# Altium project 2015PCB1.PrjPCB
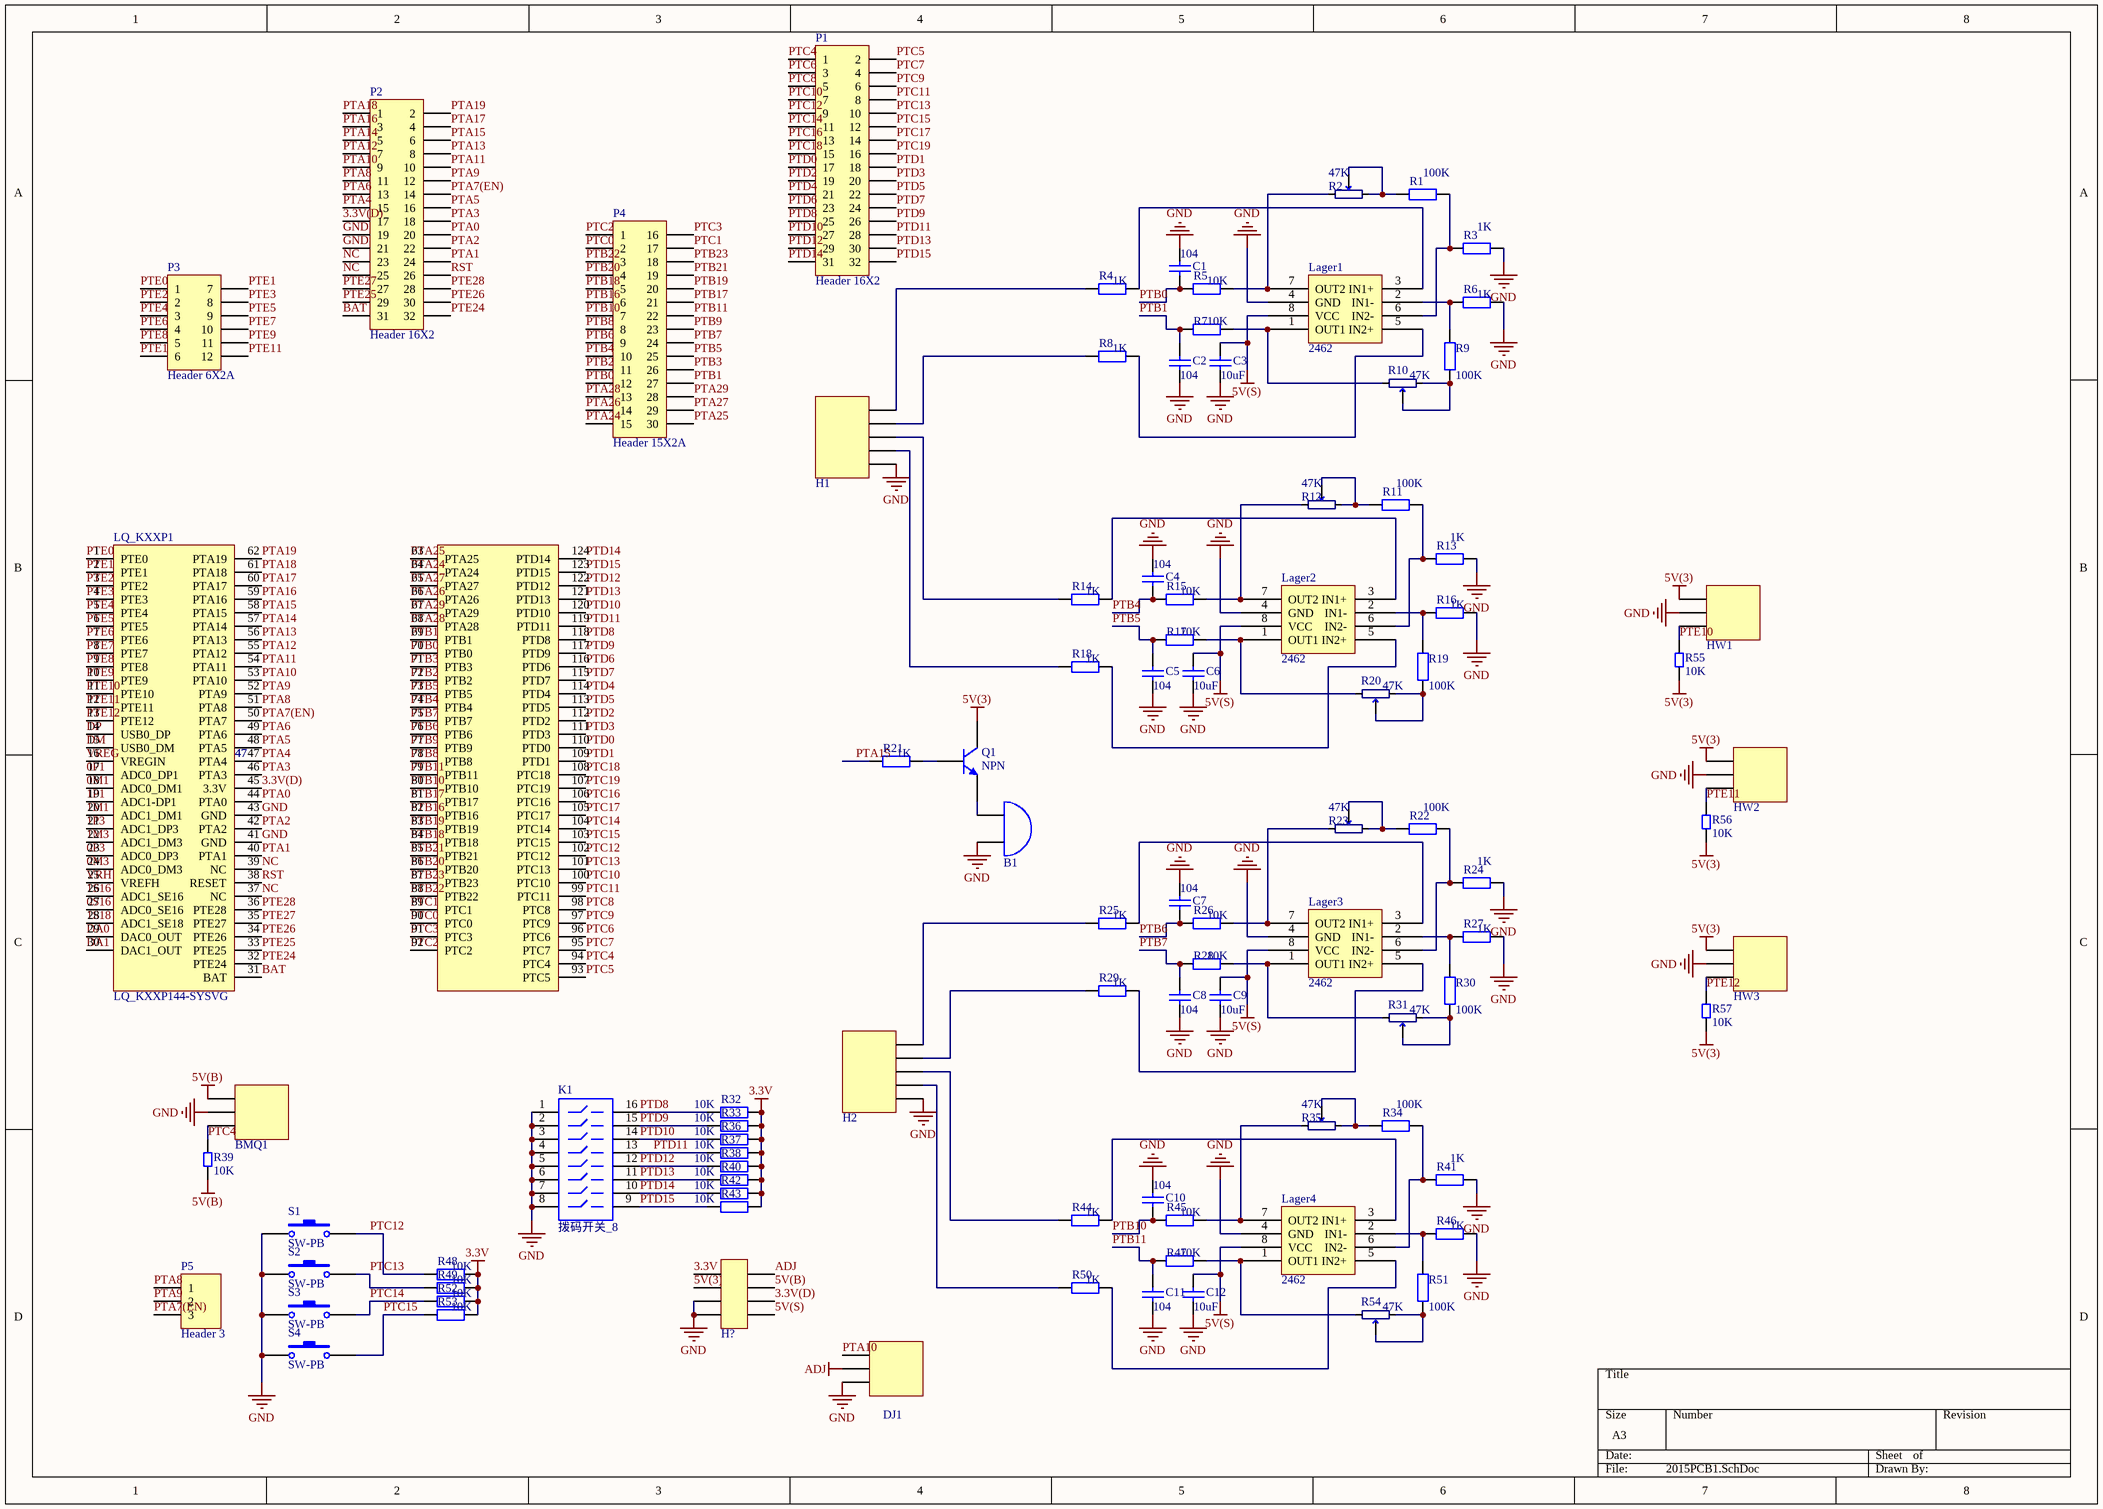
[diagram p0: 2015PCB1.SchDoc]
1 sheet, 94 parts. Net scope: global (net labels, ports and power ports of the same name join across sheets).
Board file: 2015PCB1.PcbDoc

## Sheet 2015PCB1.SchDoc
size A3

### Parts
B1  BELL  [bell]  (value not drawn)
BMQ1  HEADER  [干簧管]  (value not drawn)
C1  value 104  [PCBComponent_1]  (hidden comment: Cap)
C2  value 104  [PCBComponent_1]  (hidden comment: Cap)
C3  value 10uF  [PCBComponent_1]  (hidden comment: Cap)
C4  value 104  [PCBComponent_1]  (hidden comment: Cap)
C5  value 104  [PCBComponent_1]  (hidden comment: Cap)
C6  value 10uF  [PCBComponent_1]  (hidden comment: Cap)
C7  value 104  [PCBComponent_1]  (hidden comment: Cap)
C8  value 104  [PCBComponent_1]  (hidden comment: Cap)
C9  value 10uF  [PCBComponent_1]  (hidden comment: Cap)
C10  value 104  [PCBComponent_1]  (hidden comment: Cap)
C11  value 104  [PCBComponent_1]  (hidden comment: Cap)
C12  value 10uF  [PCBComponent_1]  (hidden comment: Cap)
DJ1  HEADER  [干簧管]  (value not drawn)
H1  HEADER  [HEADER5]  (value not drawn)
H2  HEADER  [HEADER5]  (value not drawn)
H?  HEADER4X2  [HEADER4X2]  (value not drawn)
HW1  HEADER  [干簧管]  (value not drawn)
HW2  HEADER  [干簧管]  (value not drawn)
HW3  HEADER  [干簧管]  (value not drawn)
K1  拨码开关_8  [拨码开关]
Lager1  2462  [SOIC127P600X175-8N]
Lager2  2462  [SOIC127P600X175-8N]
Lager3  2462  [SOIC127P600X175-8N]
Lager4  2462  [SOIC127P600X175-8N]
LQ_KXXP1  LQ_KXXP144-SYSVG  [LQ_KXXP144-SYSVG]
P1  Header 16X2  [HDR2X16]
P2  Header 16X2  [HDR2X16]
P3  Header 6X2A  [HDR2X6_CEN]
P4  Header 15X2A  [HDR2X15_CEN]
P5  Header 3  [HDR1X3]
Q1  NPN  [TO-226]
R1  value 100K  [0805]  (hidden comment: Res2)
R2  47K  [精密可调电位器]
R3  value 1K  [0805]  (hidden comment: Res2)
R4  value 1K  [0805]  (hidden comment: Res2)
R5  value 10K  [0805]  (hidden comment: Res2)
R6  value 1K  [0805]  (hidden comment: Res2)
R7  value 10K  [0805]  (hidden comment: Res2)
R8  value 1K  [0805]  (hidden comment: Res2)
R9  value 100K  [0805]  (hidden comment: Res2)
R10  47K  [精密可调电位器]
R11  value 100K  [0805]  (hidden comment: Res2)
R12  47K  [精密可调电位器]
R13  value 1K  [0805]  (hidden comment: Res2)
R14  value 1K  [0805]  (hidden comment: Res2)
R15  value 10K  [0805]  (hidden comment: Res2)
R16  value 1K  [0805]  (hidden comment: Res2)
R17  value 10K  [0805]  (hidden comment: Res2)
R18  value 1K  [0805]  (hidden comment: Res2)
R19  value 100K  [0805]  (hidden comment: Res2)
R20  47K  [精密可调电位器]
R21  value 1K  [0805]  (hidden comment: Res2)
R22  value 100K  [0805]  (hidden comment: Res2)
R23  47K  [精密可调电位器]
R24  value 1K  [0805]  (hidden comment: Res2)
R25  value 1K  [0805]  (hidden comment: Res2)
R26  value 10K  [0805]  (hidden comment: Res2)
R27  value 1K  [0805]  (hidden comment: Res2)
R28  value 10K  [0805]  (hidden comment: Res2)
R29  value 1K  [0805]  (hidden comment: Res2)
R30  value 100K  [0805]  (hidden comment: Res2)
R31  47K  [精密可调电位器]
R32  value 10K  [0805]  (hidden comment: Res2)
R33  value 10K  [0805]  (hidden comment: Res2)
R34  value 100K  [0805]  (hidden comment: Res2)
R35  47K  [精密可调电位器]
R36  value 10K  [0805]  (hidden comment: Res2)
R37  value 10K  [0805]  (hidden comment: Res2)
R38  value 10K  [0805]  (hidden comment: Res2)
R39  value 10K  [0805]  (hidden comment: RES)
R40  value 10K  [0805]  (hidden comment: Res2)
R41  value 1K  [0805]  (hidden comment: Res2)
R42  value 10K  [0805]  (hidden comment: Res2)
R43  value 10K  [0805]  (hidden comment: Res2)
R44  value 1K  [0805]  (hidden comment: Res2)
R45  value 10K  [0805]  (hidden comment: Res2)
R46  value 1K  [0805]  (hidden comment: Res2)
R47  value 10K  [0805]  (hidden comment: Res2)
R48  value 10K  [0805]  (hidden comment: Res2)
R49  value 10K  [0805]  (hidden comment: Res2)
R50  value 1K  [0805]  (hidden comment: Res2)
R51  value 100K  [0805]  (hidden comment: Res2)
R52  value 10K  [0805]  (hidden comment: Res2)
R53  value 10K  [0805]  (hidden comment: Res2)
R54  47K  [精密可调电位器]
R55  value 10K  [0805]  (hidden comment: RES)
R56  value 10K  [0805]  (hidden comment: RES)
R57  value 10K  [0805]  (hidden comment: RES)
S1  SW-PB  [2012[0805]]
S2  SW-PB  [2012[0805]]
S3  SW-PB  [2012[0805]]
S4  SW-PB  [2012[0805]]

### Nets
3.3V: H?.1 R32.2 R33.2 R36.2 R37.2 R38.2 R40.2 R42.2 R43.2 R48.2 R49.2 R52.2 R53.2
5V(3): H?.2 HW1.1 HW2.1 HW3.1 Q1.1(C) R55.1 R56.1 R57.1
5V(B): BMQ1.1 H?.7 R39.1
5V(S): C3.1 C6.1 C9.1 C12.1 H?.5 Lager1.8(VCC) Lager2.8(VCC) Lager3.8(VCC) Lager4.8(VCC)
ADJ: DJ1.2 H?.8
GND: B1.2 BMQ1.2 C1.1 C2.1 C3.2 C4.1 C5.1 C6.2 C7.1 C8.1 C9.2 C10.1 C11.1 C12.2 DJ1.3 H1.1 H2.1 H?.3 H?.4 HW1.2 HW2.2 HW3.2 K1.1 K1.2 K1.3 K1.4 K1.5 K1.6 K1.7 K1.8 Lager1.4(GND) Lager2.4(GND) Lager3.4(GND) Lager4.4(GND) LQ_KXXP1.41(GND) LQ_KXXP1.43(GND) P2.19 P2.21 R3.2 R6.2 R13.2 R16.2 R24.2 R27.2 R41.2 R46.2 S1.1 S2.1 S3.1 S4.1
0M1: LQ_KXXP1.18(ADC0_DM1)
0M3: LQ_KXXP1.24(ADC0_DM3)
0P1: LQ_KXXP1.17(ADC0_DP1)
0P3: LQ_KXXP1.23(ADC0_DP3)
0S16: LQ_KXXP1.27(ADC0_SE16)
1M1: LQ_KXXP1.20(ADC1_DM1)
1M3: LQ_KXXP1.22(ADC1_DM3)
1P1: LQ_KXXP1.19(ADC1-DP1)
1P3: LQ_KXXP1.21(ADC1_DP3)
1S16: LQ_KXXP1.26(ADC1_SE16)
1S18: LQ_KXXP1.28(ADC1_SE18)
3.3V(D): H?.6 LQ_KXXP1.45(3.3V) P2.17
BAT: LQ_KXXP1.31(BAT) P2.31
DA0: LQ_KXXP1.29(DAC0_OUT)
DA1: LQ_KXXP1.30(DAC1_OUT)
DM: LQ_KXXP1.15(USB0_DM)
DP: LQ_KXXP1.14(USB0_DP)
NC: LQ_KXXP1.37(NC) LQ_KXXP1.39(NC) P2.23 P2.25
PTA0: LQ_KXXP1.44(PTA0) P2.20
PTA1: LQ_KXXP1.40(PTA1) P2.24
PTA2: LQ_KXXP1.42(PTA2) P2.22
PTA3: LQ_KXXP1.46(PTA3) P2.18
PTA4: LQ_KXXP1.47(PTA4) P2.15
PTA5: LQ_KXXP1.48(PTA5) P2.16
PTA6: LQ_KXXP1.49(PTA6) P2.13
PTA7(EN): LQ_KXXP1.50(PTA7) P2.14 P5.3
PTA8: LQ_KXXP1.51(PTA8) P2.11 P5.1
PTA9: LQ_KXXP1.52(PTA9) P2.12 P5.2
PTA10: DJ1.1 LQ_KXXP1.53(PTA10) P2.9
PTA11: LQ_KXXP1.54(PTA11) P2.10
PTA12: LQ_KXXP1.55(PTA12) P2.7
PTA13: LQ_KXXP1.56(PTA13) P2.8
PTA14: LQ_KXXP1.57(PTA14) P2.5
PTA15: LQ_KXXP1.58(PTA15) P2.6 R21.1
PTA16: LQ_KXXP1.59(PTA16) P2.3
PTA17: LQ_KXXP1.60(PTA17) P2.4
PTA18: LQ_KXXP1.61(PTA18) P2.1
PTA19: LQ_KXXP1.62(PTA19) P2.2
PTA24: LQ_KXXP1.64(PTA24) P4.15
PTA25: LQ_KXXP1.63(PTA25) P4.30
PTA26: LQ_KXXP1.66(PTA26) P4.14
PTA27: LQ_KXXP1.65(PTA27) P4.29
PTA28: LQ_KXXP1.68(PTA28) P4.13
PTA29: LQ_KXXP1.67(PTA29) P4.28
PTB0: C1.2 LQ_KXXP1.70(PTB0) P4.12 R5.1
PTB1: C2.2 LQ_KXXP1.69(PTB1) P4.27 R7.1
PTB2: LQ_KXXP1.72(PTB2) P4.11
PTB3: LQ_KXXP1.71(PTB3) P4.26
PTB4: C4.2 LQ_KXXP1.74(PTB4) P4.10 R15.1
PTB5: C5.2 LQ_KXXP1.73(PTB5) P4.25 R17.1
PTB6: C7.2 LQ_KXXP1.76(PTB6) P4.9 R26.1
PTB7: C8.2 LQ_KXXP1.75(PTB7) P4.24 R28.1
PTB8: LQ_KXXP1.78(PTB8) P4.8
PTB9: LQ_KXXP1.77(PTB9) P4.23
PTB10: C10.2 LQ_KXXP1.80(PTB10) P4.7 R45.1
PTB11: C11.2 LQ_KXXP1.79(PTB11) P4.22 R47.1
PTB16: LQ_KXXP1.82(PTB16) P4.6
PTB17: LQ_KXXP1.81(PTB17) P4.21
PTB18: LQ_KXXP1.84(PTB18) P4.5
PTB19: LQ_KXXP1.83(PTB19) P4.20
PTB20: LQ_KXXP1.86(PTB20) P4.4
PTB21: LQ_KXXP1.85(PTB21) P4.19
PTB22: LQ_KXXP1.88(PTB22) P4.3
PTB23: LQ_KXXP1.87(PTB23) P4.18
PTC0: LQ_KXXP1.90(PTC0) P4.2
PTC1: LQ_KXXP1.89(PTC1) P4.17
PTC2: LQ_KXXP1.92(PTC2) P4.1
PTC3: LQ_KXXP1.91(PTC3) P4.16
PTC4: BMQ1.3 LQ_KXXP1.94(PTC4) P1.1 R39.2
PTC5: LQ_KXXP1.93(PTC5) P1.2
PTC6: LQ_KXXP1.96(PTC6) P1.3
PTC7: LQ_KXXP1.95(PTC7) P1.4
PTC8: LQ_KXXP1.98(PTC8) P1.5
PTC9: LQ_KXXP1.97(PTC9) P1.6
PTC10: LQ_KXXP1.100(PTC10) P1.7
PTC11: LQ_KXXP1.99(PTC11) P1.8
PTC12: LQ_KXXP1.102(PTC12) P1.9 R48.1 S1.2
PTC13: LQ_KXXP1.101(PTC13) P1.10 R49.1 S2.2
PTC14: LQ_KXXP1.104(PTC14) P1.11 R52.1 S3.2
PTC15: LQ_KXXP1.103(PTC15) P1.12 R53.1 S4.2
PTC16: LQ_KXXP1.106(PTC16) P1.13
PTC17: LQ_KXXP1.105(PTC17) P1.14
PTC18: LQ_KXXP1.108(PTC18) P1.15
PTC19: LQ_KXXP1.107(PTC19) P1.16
PTD0: LQ_KXXP1.110(PTD0) P1.17
PTD1: LQ_KXXP1.109(PTD1) P1.18
PTD2: LQ_KXXP1.112(PTD2) P1.19
PTD3: LQ_KXXP1.111(PTD3) P1.20
PTD4: LQ_KXXP1.114(PTD4) P1.21
PTD5: LQ_KXXP1.113(PTD5) P1.22
PTD6: LQ_KXXP1.116(PTD6) P1.23
PTD7: LQ_KXXP1.115(PTD7) P1.24
PTD8: K1.16 LQ_KXXP1.118(PTD8) P1.25 R32.1
PTD9: K1.15 LQ_KXXP1.117(PTD9) P1.26 R33.1
PTD10: K1.14 LQ_KXXP1.120(PTD10) P1.27 R36.1
PTD11: K1.13 LQ_KXXP1.119(PTD11) P1.28 R37.1
PTD12: K1.12 LQ_KXXP1.122(PTD12) P1.29 R38.1
PTD13: K1.11 LQ_KXXP1.121(PTD13) P1.30 R40.1
PTD14: K1.10 LQ_KXXP1.124(PTD14) P1.31 R42.1
PTD15: K1.9 LQ_KXXP1.123(PTD15) P1.32 R43.1
PTE0: LQ_KXXP1.1(PTE0) P3.1
PTE1: LQ_KXXP1.2(PTE1) P3.7
PTE2: LQ_KXXP1.3(PTE2) P3.2
PTE3: LQ_KXXP1.4(PTE3) P3.8
PTE4: LQ_KXXP1.5(PTE4) P3.3
PTE5: LQ_KXXP1.6(PTE5) P3.9
PTE6: LQ_KXXP1.7(PTE6) P3.4
PTE7: LQ_KXXP1.8(PTE7) P3.10
PTE8: LQ_KXXP1.9(PTE8) P3.5
PTE9: LQ_KXXP1.10(PTE9) P3.11
PTE10: HW1.3 LQ_KXXP1.11(PTE10) P3.6 R55.2
PTE11: HW2.3 LQ_KXXP1.12(PTE11) P3.12 R56.2
PTE12: HW3.3 LQ_KXXP1.13(PTE12) R57.2
PTE24: LQ_KXXP1.32(PTE24) P2.32
PTE25: LQ_KXXP1.33(PTE25) P2.29
PTE26: LQ_KXXP1.34(PTE26) P2.30
PTE27: LQ_KXXP1.35(PTE27) P2.27
PTE28: LQ_KXXP1.36(PTE28) P2.28
RST: LQ_KXXP1.38(RESET) P2.26
VREG: LQ_KXXP1.16(VREGIN)
VRH: LQ_KXXP1.25(VREFH)
NetB1_1: B1.1 Q1.3(E)
NetH1_2: H1.2 R8.1
NetH1_3: H1.3 R4.1
NetH1_4: H1.4 R18.1
NetH1_5: H1.5 R14.1
NetH2_2: H2.2 R44.1
NetH2_3: H2.3 R50.1
NetH2_4: H2.4 R25.1
NetH2_5: H2.5 R29.1
NetLager1_1: Lager1.1(OUT1) R7.2 R10.3
NetLager1_2: Lager1.2(IN1-) R6.1 R9.1
NetLager1_3: Lager1.3(IN1+) R4.2
NetLager1_5: Lager1.5(IN2+) R8.2
NetLager1_6: Lager1.6(IN2-) R1.2 R3.1
NetLager1_7: Lager1.7(OUT2) R2.1 R5.2
NetLager2_1: Lager2.1(OUT1) R17.2 R20.3
NetLager2_2: Lager2.2(IN1-) R16.1 R19.1
NetLager2_3: Lager2.3(IN1+) R14.2
NetLager2_5: Lager2.5(IN2+) R18.2
NetLager2_6: Lager2.6(IN2-) R11.2 R13.1
NetLager2_7: Lager2.7(OUT2) R12.1 R15.2
NetLager3_1: Lager3.1(OUT1) R28.2 R31.3
NetLager3_2: Lager3.2(IN1-) R27.1 R30.1
NetLager3_3: Lager3.3(IN1+) R25.2
NetLager3_5: Lager3.5(IN2+) R29.2
NetLager3_6: Lager3.6(IN2-) R22.2 R24.1
NetLager3_7: Lager3.7(OUT2) R23.1 R26.2
NetLager4_1: Lager4.1(OUT1) R47.2 R54.3
NetLager4_2: Lager4.2(IN1-) R46.1 R51.1
NetLager4_3: Lager4.3(IN1+) R44.2
NetLager4_5: Lager4.5(IN2+) R50.2
NetLager4_6: Lager4.6(IN2-) R34.2 R41.1
NetLager4_7: Lager4.7(OUT2) R35.1 R45.2
NetQ1_2: Q1.2(B) R21.2
NetR1_1: R1.1 R2.2 R2.3
NetR9_2: R9.2 R10.1 R10.2
NetR11_1: R11.1 R12.2 R12.3
NetR19_2: R19.2 R20.1 R20.2
NetR22_1: R22.1 R23.2 R23.3
NetR30_2: R30.2 R31.1 R31.2
NetR34_1: R34.1 R35.2 R35.3
NetR51_2: R51.2 R54.1 R54.2

### Library data of the parts
B1 = bell: 直插蜂鸣器
BMQ1 DJ1 HW1-HW3 = HEADER3
C1-C12 = Cap: Capacitor; Published: 8-Jun-2000; LatestRevisionDate: 17-Jul-2002; LatestRevisionNote: Re-released for DXP Platform.; PackageReference: RAD-0.3; Publisher: Altium Limited
H1 H2 = HEADER5: CCD接口
Lager1-Lager4 = BTS7970B_3: 驱动
P1 P2 = Header 16X2: Header, 16-Pin, Dual row; LatestRevisionDate: 17-Jul-2002; LatestRevisionNote: Re-released for DXP Platform.; Publisher: Altium Limited
P3 = Header 6X2A: Header, 6-Pin, Dual row; LatestRevisionDate: 17-Jul-2002; LatestRevisionNote: Re-released for DXP Platform.; Publisher: Altium Limited
P4 = Header 15X2A: Header, 15-Pin, Dual row; LatestRevisionDate: 17-Jul-2002; LatestRevisionNote: Re-released for DXP Platform.; Publisher: Altium Limited
P5 = Header 3: Header, 3-Pin; LatestRevisionDate: 17-Jul-2002; LatestRevisionNote: Re-released for DXP Platform.; Publisher: Altium Limited
Q1 = NPN: NPN Bipolar Transistor; Published: 8-Jun-2000; LatestRevisionDate: 17-Jul-2002; LatestRevisionNote: Re-released for DXP Platform.; PackageReference: TO-226; Publisher: Altium Limited; Code_JEDEC: TO-226-AA
R1 R3-R9 R11 R13-R19 R21 R22 R24-R30 R32-R34 R36-R38 R40-R53 = Res2: Resistor; Published: 8-Jun-2000; LatestRevisionDate: 17-Jul-2002; LatestRevisionNote: Re-released for DXP Platform.; PackageReference: AXIAL-0.4; Publisher: Altium Limited; PackageDescription: Axial Device, Thru-Hole; 2 Leads; 0.4 in Pin Spacing
R2 R10 R12 R20 R23 R31 R35 R54 = 精密可调电位器
R39 R55-R57 = 0805-电阻
S1-S4 = SW-PB: Switch; Published: 24-Mar-1999; LatestRevisionDate: 17-Jul-2002; LatestRevisionNote: Re-released for DXP Platform.; PackageReference: SPST-2; Publisher: Altium Limited